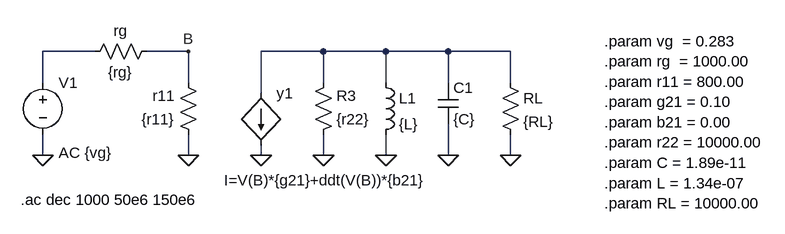
[diagram p0: schematic eje1.asc]
eje1.asc, the LTspice schematic file:
Version 4
SHEET 1 1068 680
WIRE 0 80 -80 80
WIRE 144 80 80 80
WIRE 352 80 256 80
WIRE 448 80 352 80
WIRE 544 80 448 80
WIRE 640 80 544 80
WIRE -80 128 -80 80
WIRE 144 128 144 80
WIRE 352 128 352 80
WIRE 448 128 448 80
WIRE 544 128 544 80
WIRE 640 128 640 80
WIRE 256 144 256 80
WIRE -80 240 -80 208
WIRE 144 240 144 208
WIRE 256 240 256 224
WIRE 352 240 352 208
WIRE 448 240 448 208
WIRE 544 240 544 192
WIRE 640 240 640 208
FLAG 352 240 0
FLAG 448 240 0
FLAG 544 240 0
FLAG 256 240 0
FLAG 144 240 0
FLAG -80 240 0
FLAG 640 240 0
FLAG 144 80 B
SYMBOL voltage -80 112 R0
WINDOW 123 24 124 Left 2
WINDOW 39 0 0 Left 2
SYMATTR InstName V1
SYMATTR Value ""
SYMATTR Value2 AC {vg}
SYMBOL res 160 224 R180
WINDOW 0 36 76 Left 2
WINDOW 3 36 40 Left 2
SYMATTR InstName r11
SYMATTR Value {r11}
SYMBOL res -16 96 R270
WINDOW 0 32 56 VTop 2
WINDOW 3 0 56 VBottom 2
SYMATTR InstName rg
SYMATTR Value {rg}
SYMBOL res 336 224 M180
WINDOW 0 36 76 Left 2
WINDOW 3 36 40 Left 2
SYMATTR InstName R3
SYMATTR Value {r22}
SYMBOL ind 432 112 R0
SYMATTR InstName L1
SYMATTR Value {L}
SYMBOL cap 528 128 R0
SYMATTR InstName C1
SYMATTR Value {C}
SYMBOL res 624 112 R0
SYMATTR InstName RL
SYMATTR Value {RL}
SYMBOL bi 256 144 R0
WINDOW 3 -57 134 Left 2
SYMATTR Value I=V(B)*{g21}+ddt(V(B))*{b21}
SYMATTR InstName y1
TEXT -114 308 Left 2 !.ac dec 1000 50e6 150e6
TEXT 784 64 Left 2 !.param vg  = 0.283\n.param rg  = 1000.00\n.param r11 = 800.00\n.param g21 = 0.10\n.param b21 = 0.00\n.param r22 = 10000.00\n.param C = 1.89e-11\n.param L = 1.34e-07\n.param RL = 10000.00

The netlist it stands for:
* eje1.asc
V1 N001 0 AC {vg}
r11 0 B {r11}
rg N001 B {rg}
R3 0 N002 {r22}
L1 N002 0 {L}
C1 N002 0 {C}
RL N002 0 {RL}
B§y1 N002 0 I=V(B)*{g21}+ddt(V(B))*{b21}
.ac dec 1000 50e6 150e6
.param vg  = 0.283
.param rg  = 1000.00
.param r11 = 800.00
.param g21 = 0.10
.param b21 = 0.00
.param r22 = 10000.00
.param C = 1.89e-11
.param L = 1.34e-07
.param RL = 10000.00
.backanno
.end